# EAGLE schematic KeepUntil-v1.0 (EAGLE 7.5.0)
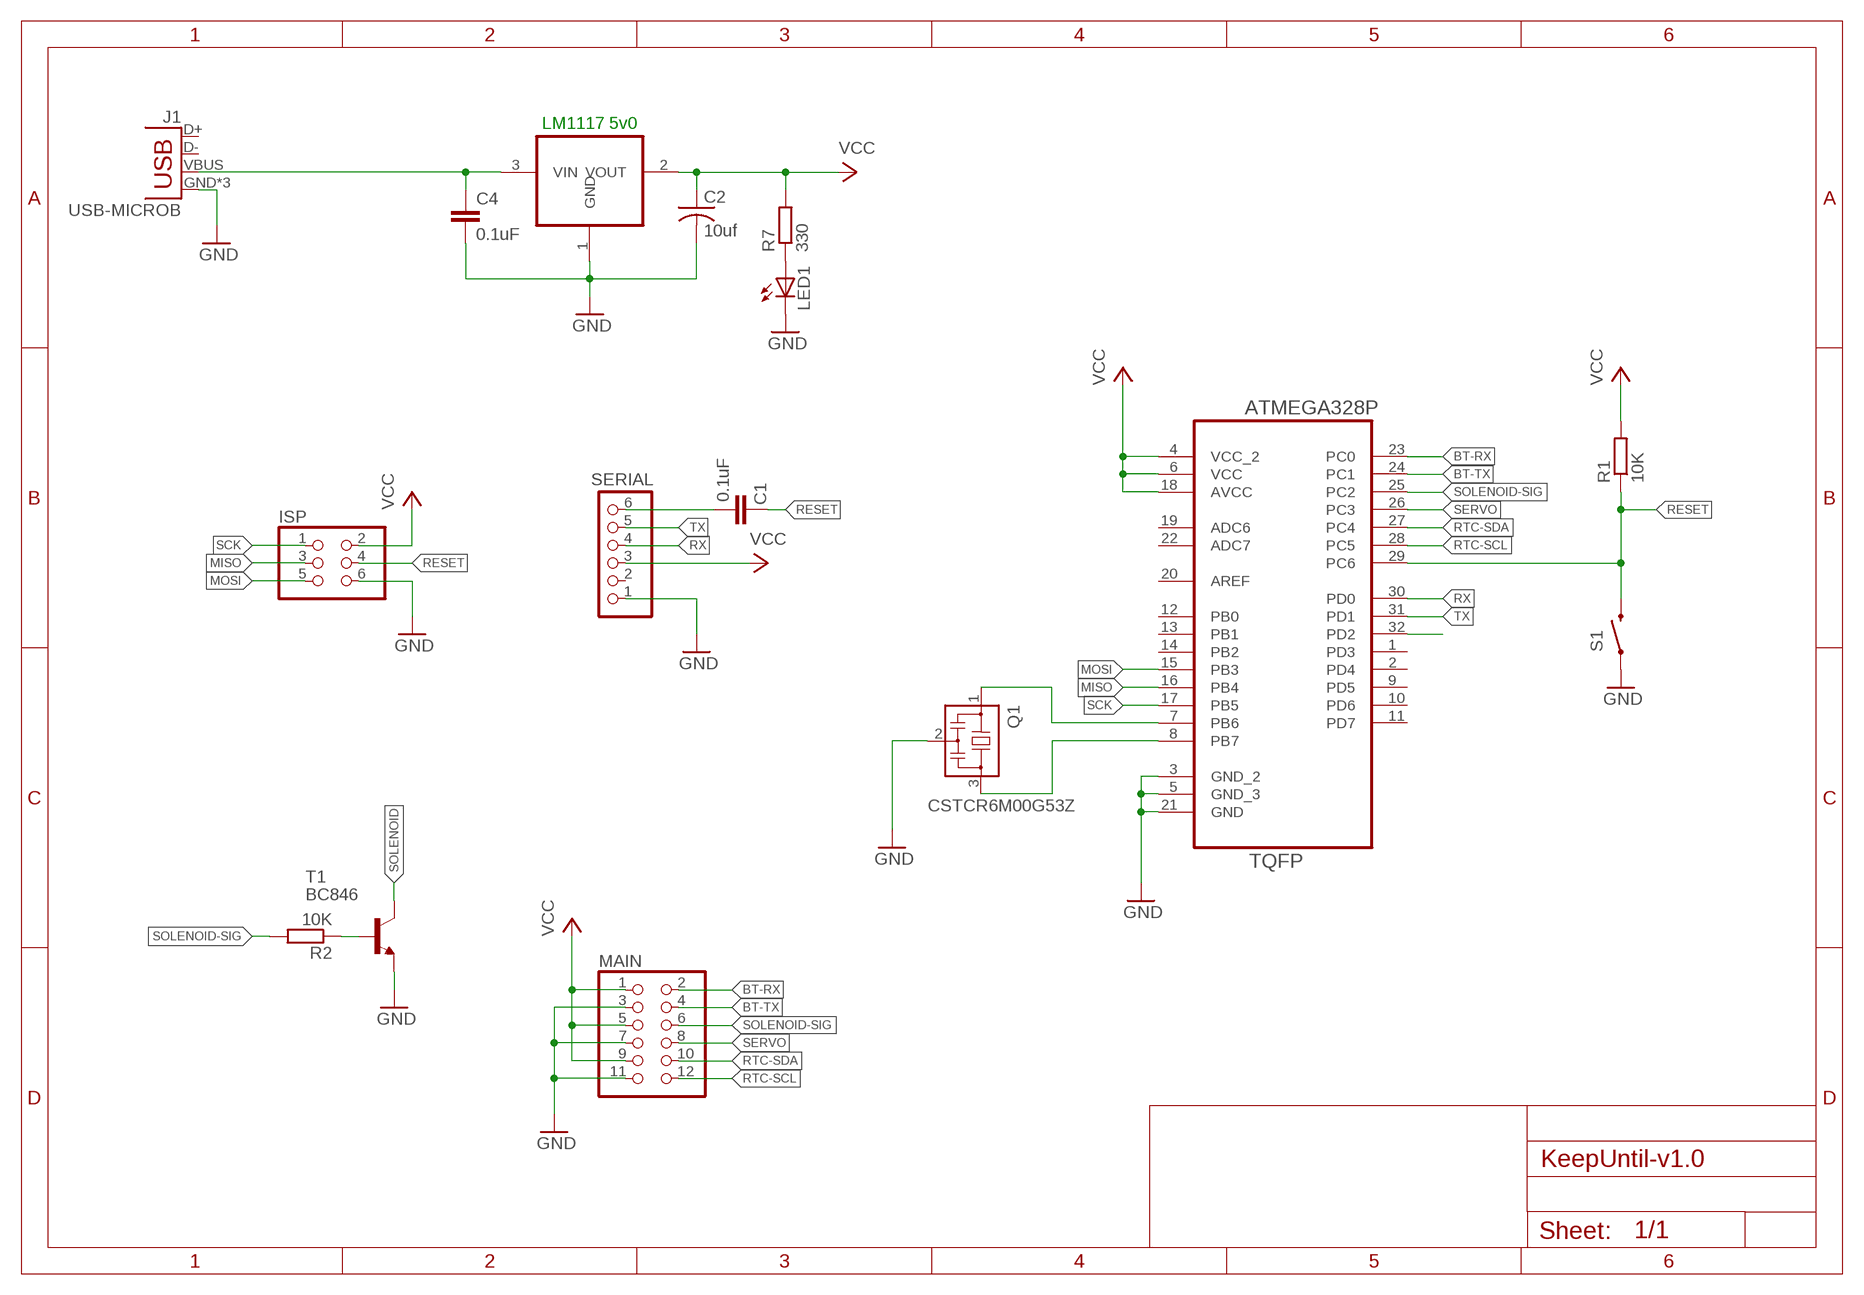
[diagram p0: schematic, sheet 1]

## Parts
C1  0.1uF  C-EUC0805  [C0805]
C2  10uf  C-USC1206  [C1206]
C4  0.1uF  C-EUC0805  [C0805]
IC2  REG1117  [SOT223]
ISP  PINHD-2X3  [2X03]
J1  USB-MICROB  [USB-MICROB]
LED1  LEDSMT1206  [1206]
MAIN  PINHD-2X6  [2X06]
Q1  CSTCR6M00G53Z  [CSTCR6M]
R1  10K  R-EU_R0805  [R0805]
R2  10K  R-EU_R0805  [R0805]
R7  330  R-EU_R0805  [R0805]
S1  SWITCH-MOMENTARY-2SMD-1101NE  [TACTILE-SWITCH-1101NE]
SERIAL  PINHD-1X6  [1X06]
T1  BC846  [SOT23]
U1  ATMEGA328P-AU  [QFP80P900X900X120-32N]

## Nets
BT-RX: MAIN.2 U1.23(PC0)
BT-TX: MAIN.4 U1.24(PC1)
GND: C2.2 C4.2 IC2.1(GND) ISP.6 J1.GND J1.MT1(GND) J1.MT2(GND) LED1.C MAIN.3 MAIN.7 MAIN.11 Q1.2 S1.1 SERIAL.1 T1.2(E) U1.3(GND_2) U1.5(GND_3) U1.21(GND)
MISO: ISP.3 U1.16(PB4)
MOSI: ISP.5 U1.15(PB3)
N$1: Q1.1 U1.7(PB6)
N$2: Q1.3 U1.8(PB7)
N$3: R2.1 T1.1(B)
N$4: C4.1 IC2.3(VIN) J1.VBUS
N$7: LED1.A R7.1
N$17: C1.2 SERIAL.6
RESET: C1.1 ISP.4 R1.1 S1.2 U1.29(PC6)
RTC-SCL: MAIN.12 U1.28(PC5)
RTC-SDA: MAIN.10 U1.27(PC4)
RX: SERIAL.4 U1.30(PD0)
SCK: ISP.1 U1.17(PB5)
SERVO: MAIN.8 U1.26(PC3)
SOLENOID: T1.3(C)
SOLENOID-SIG: MAIN.6 R2.2 U1.25(PC2) U1.32(PD2)
TX: SERIAL.5 U1.31(PD1)
VCC: C2.1 IC2.2(VOUT) ISP.2 MAIN.1 MAIN.5 MAIN.9 R1.2 R7.2 SERIAL.3 U1.4(VCC_2) U1.6(VCC) U1.18(AVCC)
Unconnected: J1.D+ J1.D- SERIAL.2 U1.1(PD3) U1.2(PD4) U1.9(PD5) U1.10(PD6) U1.11(PD7) U1.12(PB0) U1.13(PB1) U1.14(PB2) U1.19(ADC6) U1.20(AREF) U1.22(ADC7)

## Notes on the sheet
- LM1117 5v0

## Library data of the parts
C1 C4 = resistor:C-EU: CAPACITOR, European symbol
C2 = resistor:C-US: CAPACITOR, American symbol
IC2 = burr-brown:REG1117: 800mA and 1A Low Dropout (LDO) Positive Regulator 1.8V, 2.5V, 2.85V, 3.3V, 5V, and Adj; MPN: LM1117 3v3; OC_FARNELL: 1097566; OC_NEWARK: 14P6981
ISP = pinhead:PINHD-2X3: PIN HEADER
J1 = SparkFun-Connectors:USB: USB Connectors USB-B-PTH is fully proven SKU : PRT-00139/CONN-08278 USB-miniB is fully proven SKU : PRT-00587 USB-A-PCB is untested. USB-A-H is throughly reviewed, but untested. Spark Fun Electronics SKU : PRT-00437 USB-B-SMT is throughly reviewed, but untested. Needs silkscreen touching up. USB-A-S has not been used/tested USB-MB-H has not been used/tested USB-MICROB has been used. CONN-09505; PROD_ID: CONN-09505
LED1 = led:LED: LED OSRAM: - CHIPLED LG R971, LG N971, LY N971, LG Q971, LY Q971, LO R971, LY R971 LH N974, LH R974 LS Q976, LO Q976, LY Q976 LO Q996 - Hyper CHIPLED LW Q18S LB Q993, LB Q99A, LB R99A - SideLED LS A670, LO A670, LY A670, LG A670, LP A670 LB A673, LV A673, LT A673, LW A673 LH A674 LY A675 LS A676, LA A676, LO A676, LY A676, LW A676 LS A679, LY A679, LG A679 - Hyper Micro SIDELED® LS Y876, LA Y876, LO Y876, LY Y876 LT Y87S - SmartLED LW L88C, LW L88S LB L89C, LB L89S, LG L890 LS L89K, LO L89K, LY L89K LS L896, LA L896, LO L896, LY L896 - TOPLED LS T670, LO T670, LY T670, LG T670, LP T670 LSG T670, LSP T670, LSY T670, LOP T670, LYG T670 LG T671, LOG T671, LSG T671 LB T673, LV T673, LT T673, LW T673 LH T674 LS T676, LA T676, LO T676, LY T676, LB T676, LH T676, LSB T676, LW T676 LB T67C, LV T67C, LT T67C, LS T67K, LO T67K, LY T67K, LW E67C LS E67B, LA E67B, LO E67B, LY E67B, LB E67C, LV E67C, LT E67C LW T67C LS T679, LY T679, LG T679 LS T770, LO T770, LY T770, LG T770, LP T770 LB T773, LV T773, LT T773, LW T773 LH T774 LS E675, LA E675, LY E675, LS T675 LS T776, LA T776, LO T776, LY T776, LB T776 LHGB T686 LT T68C, LB T68C - Hyper Mini TOPLED® LB M676 - Mini TOPLED Santana® LG M470 LS M47K, LO M47K, LY M47K Source: http://www.osram.convergy.de LUXEON: - LUMILED® LXK2-PW12-R00, LXK2-PW12-S00, LXK2-PW14-U00, LXK2-PW14-V00 LXK2-PM12-R00, LXK2-PM12-S00, LXK2-PM14-U00 LXK2-PE12-Q00, LXK2-PE12-R00, LXK2-PE12-S00, LXK2-PE14-T00, LXK2-PE14-U00 LXK2-PB12-K00, LXK2-PB12-L00, LXK2-PB12-M00, LXK2-PB14-N00, LXK2-PB14-P00, LXK2-PB14-Q00 LXK2-PR12-L00, LXK2-PR12-M00, LXK2-PR14-Q00, LXK2-PR14-R00 LXK2-PD12-Q00, LXK2-PD12-R00, LXK2-PD12-S00 LXK2-PH12-R00, LXK2-PH12-S00 LXK2-PL12-P00, LXK2-PL12-Q00, LXK2-PL12-R00 Source: www.luxeon.com KINGBRIGHT: KA-3528ASYC Source: www.kingbright.com
MAIN = pinhead:PINHD-2X6: PIN HEADER
Q1 = murata-filter:CSTCR: Resonator Source: murata.co.jp; MPN: CSTCR6M00G53-R0; OC_FARNELL: 1170434; OC_NEWARK: 25M8759
R1 R2 R7 = resistor:R-EU_: RESISTOR, European symbol
S1 = SparkFun-Electromechanical:SWITCH-MOMENTARY-2: Various NO switches- pushbuttons, reed, etc; PROD_ID: SWCH-00815
SERIAL = pinhead:PINHD-1X6: PIN HEADER
T1 = transistor:BC846: NPN TRANSISTOR
U1 = Ava:ATMEGA328P-AU; DESCRIPTION: 8-bit Microcontroller with In-System Programmable Flash; MPN: ATMEGA328P-AU; OC_FARNELL: 1715486; OC_NEWARK: 14R4631; PACKAGE: TQFP-32; SUPPLIER: Atmel